# EAGLE schematic ByrneLite (EAGLE 6.3)
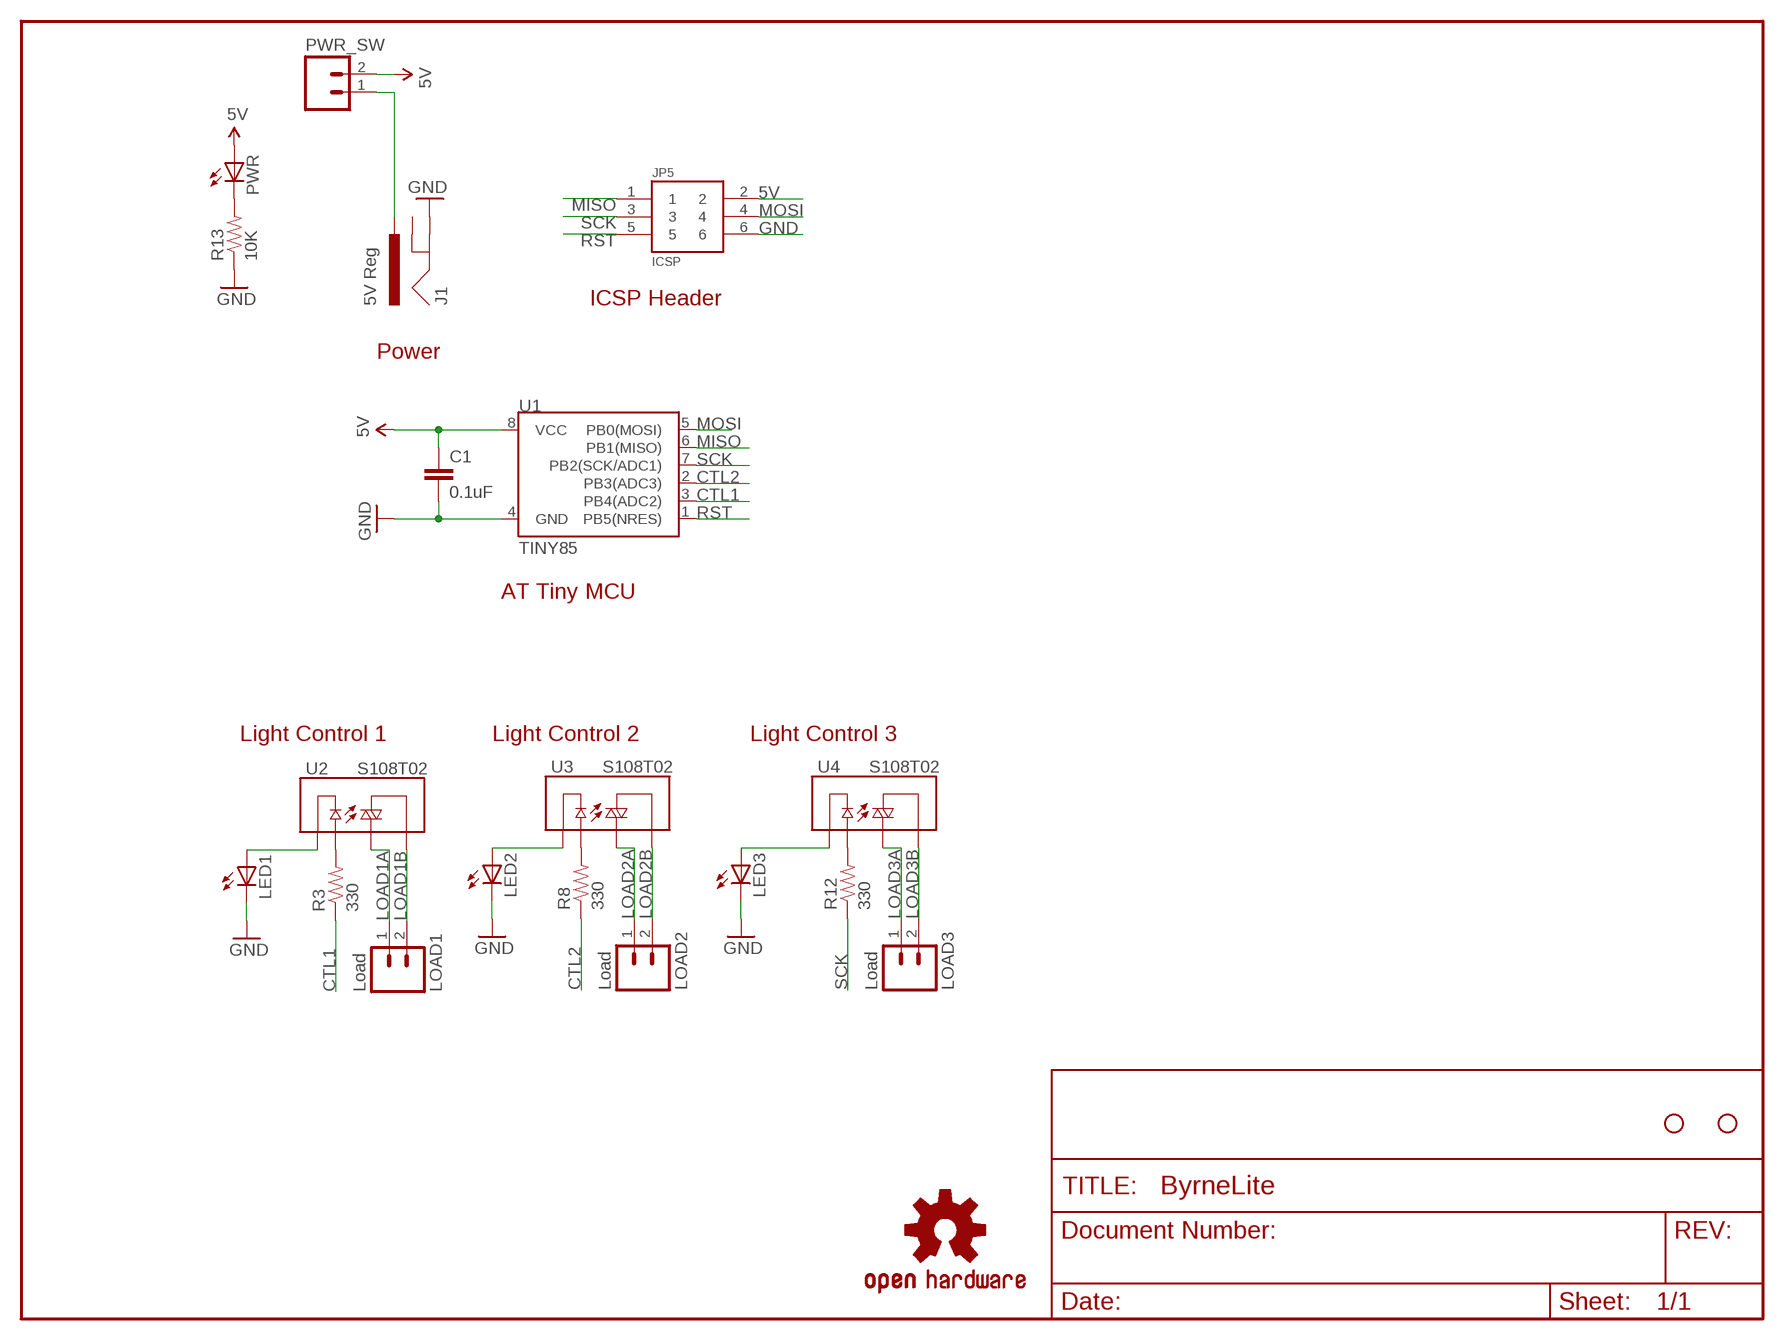
[diagram p0: schematic, sheet 1]

## Parts
C1  0.1uF  CAPPTH2  [CAP-PTH-SMALL2]
J1  5V Reg  POWER_JACKPTH_LOCK  [POWER_JACK_PTH_LOCK]
JP5  ICSP  M03X2  [2X3-SHROUDED]
LED1  LED5MM  [LED5MM]
LED2  LED5MM  [LED5MM]
LED3  LED5MM  [LED5MM]
LOAD1  Load  M025MM  [SCREWTERMINAL-5MM-2]
LOAD2  Load  M025MM  [SCREWTERMINAL-5MM-2]
LOAD3  Load  M025MM  [SCREWTERMINAL-5MM-2]
LOGO1  OSHW-LOGOM  [OSHW-LOGO-M]
PWR  LED3MM  [LED3MM]
PWR_SW  M02PTH3  [1X02_LONGPADS]
R3  330  RESISTORAXIAL-0.3  [AXIAL-0.3]
R8  330  RESISTORAXIAL-0.3  [AXIAL-0.3]
R12  330  RESISTORAXIAL-0.3  [AXIAL-0.3]
R13  10K  RESISTORAXIAL-0.3  [AXIAL-0.3]
STANDOFF2  STAND-OFF  [STAND-OFF]
STANDOFF4  STAND-OFF  [STAND-OFF]
U1  TINY85  ATTINY45TINY85-20-DIP  [DIP08]
U2  S108T02  RELAY-SOLIDSTATEPTH  [RELAY-S108T02]
U3  S108T02  RELAY-SOLIDSTATEPTH  [RELAY-S108T02]
U4  S108T02  RELAY-SOLIDSTATEPTH  [RELAY-S108T02]

## Nets
5V [pwr]: C1.1 JP5.2 PWR.A PWR_SW.2 U1.8(VCC)
CTL1: R3.P$1 U1.3(PB4(ADC2))
CTL2: R8.P$1 U1.2(PB3(ADC3))
GND [pwr]: C1.2 J1.GND JP5.6 LED1.K(C) LED2.K(C) LED3.K(C) R13.P$1 U1.4(GND)
LOAD1A [pwr]: LOAD1.1 U2.2(T2)
LOAD1B [pwr]: LOAD1.2 U2.1(T1)
LOAD2A [pwr]: LOAD2.1 U3.2(T2)
LOAD2B [pwr]: LOAD2.2 U3.1(T1)
LOAD3A [pwr]: LOAD3.1 U4.2(T2)
LOAD3B [pwr]: LOAD3.2 U4.1(T1)
MISO: JP5.1 U1.6(PB1(MISO))
MOSI: JP5.4 U1.5(PB0(MOSI))
N$1: R3.P$2 U2.3(+)
N$2: LED2.A U3.4(-)
N$3: R8.P$2 U3.3(+)
N$4: LED3.A U4.4(-)
N$5: J1.PWR PWR_SW.1
N$6: LED1.A U2.4(-)
N$7: R12.P$2 U4.3(+)
N$12: PWR.K(C) R13.P$2
RST: JP5.5 U1.1(PB5(NRES))
SCK: JP5.3 R12.P$1 U1.7(PB2(SCK/ADC1))
Unconnected: J1.GNDBREAK

## Notes on the sheet
- ICSP Header
- Power
- AT Tiny MCU
- Light Control 1 | Light Control 2 | Light Control 3

## Library data of the parts
C1 = SparkFun-Capacitors:CAP: Capacitor Standard 0603 ceramic capacitor, and 0.1" leaded capacitor.
J1 = Dek:POWER_JACK: Power Jack This is the standard 5.5mm barrel jack for power. The PTH is the most common, proven, reliable, footprint. All others are experimental. The Slot footprint only works if the mill layer is transmitted to the PCB fab house so be warned. Spark Fun Electronics SKU : PRT-00119. Mating wall wart : TOL-00298 (and others)
JP5 = SparkFun-Connectors:M03X2: 2x3 .1" header. Shrouded, with keying- CONN-10681 SMT- ??? (4UCON 15881); PROD_ID: CONN-10681
LED1-LED3 PWR = SparkFun:LED: LEDs Standard schematic elements and footprints for 5mm, 3mm, 1206, and 0603 sized LEDs. 5mm - Spark Fun Electronics SKU : COM-00529 (and others)
LOAD1-LOAD3 = SparkFun:M02: Header 2 Standard 2-pin 0.1" header. Use with straight break away headers (SKU : PRT-00116), right angle break away headers (PRT-00553), swiss pins (PRT-00743), machine pins (PRT-00117), and female headers (PRT-00115). Molex polarized connector foot print use with SKU : PRT-08233 with associated crimp pins and housings.
LOGO1 = SparkFun-Aesthetics:OSHW-LOGO: Open Source Hardware Logo This logo indicates the piece of hardware it is found on incorporates a OSHW license and/or adheres to the definition of open source hardware found here: http://freedomdefined.org/OSHW
PWR_SW = SparkFun-Connectors:M02: Header 2 Standard 2-pin 0.1" header. Use with straight break away headers (SKU : PRT-00116), right angle break away headers (PRT-00553), swiss pins (PRT-00743), machine pins (PRT-00117), and female headers (PRT-00115). Molex polarized connector foot print use with SKU : PRT-08233 with associated crimp pins and housings.
R3 R8 R12 R13 = SparkFun:RESISTOR: Resistor Basic schematic elements and footprints for 0603, 1206, and PTH resistors.
STANDOFF2 STANDOFF4 = SparkFun-Electromechanical:STAND-OFF: #4 Stand Off This is the mechanical footprint for a #4 phillips button head screw. Use the keepout ring to avoid running the screw head into surrounding components. SKU : PRT-00447
U1 = SparkFun-DigitalIC:ATTINY45: Atmel 8-pin 2/4/8kB flash uC; PROD_ID: IC-09445; VALUE: TINY85-20-DIP
U2-U4 = SparkFun:RELAY-SOLIDSTATE